# Altium schematic sheet Power Supply.SchDoc: Power Supply
size 431 x 279 mm; DocumentNumber: BMC-125-5321; Revision: A; SheetNumber: 4; SheetTotal: 6
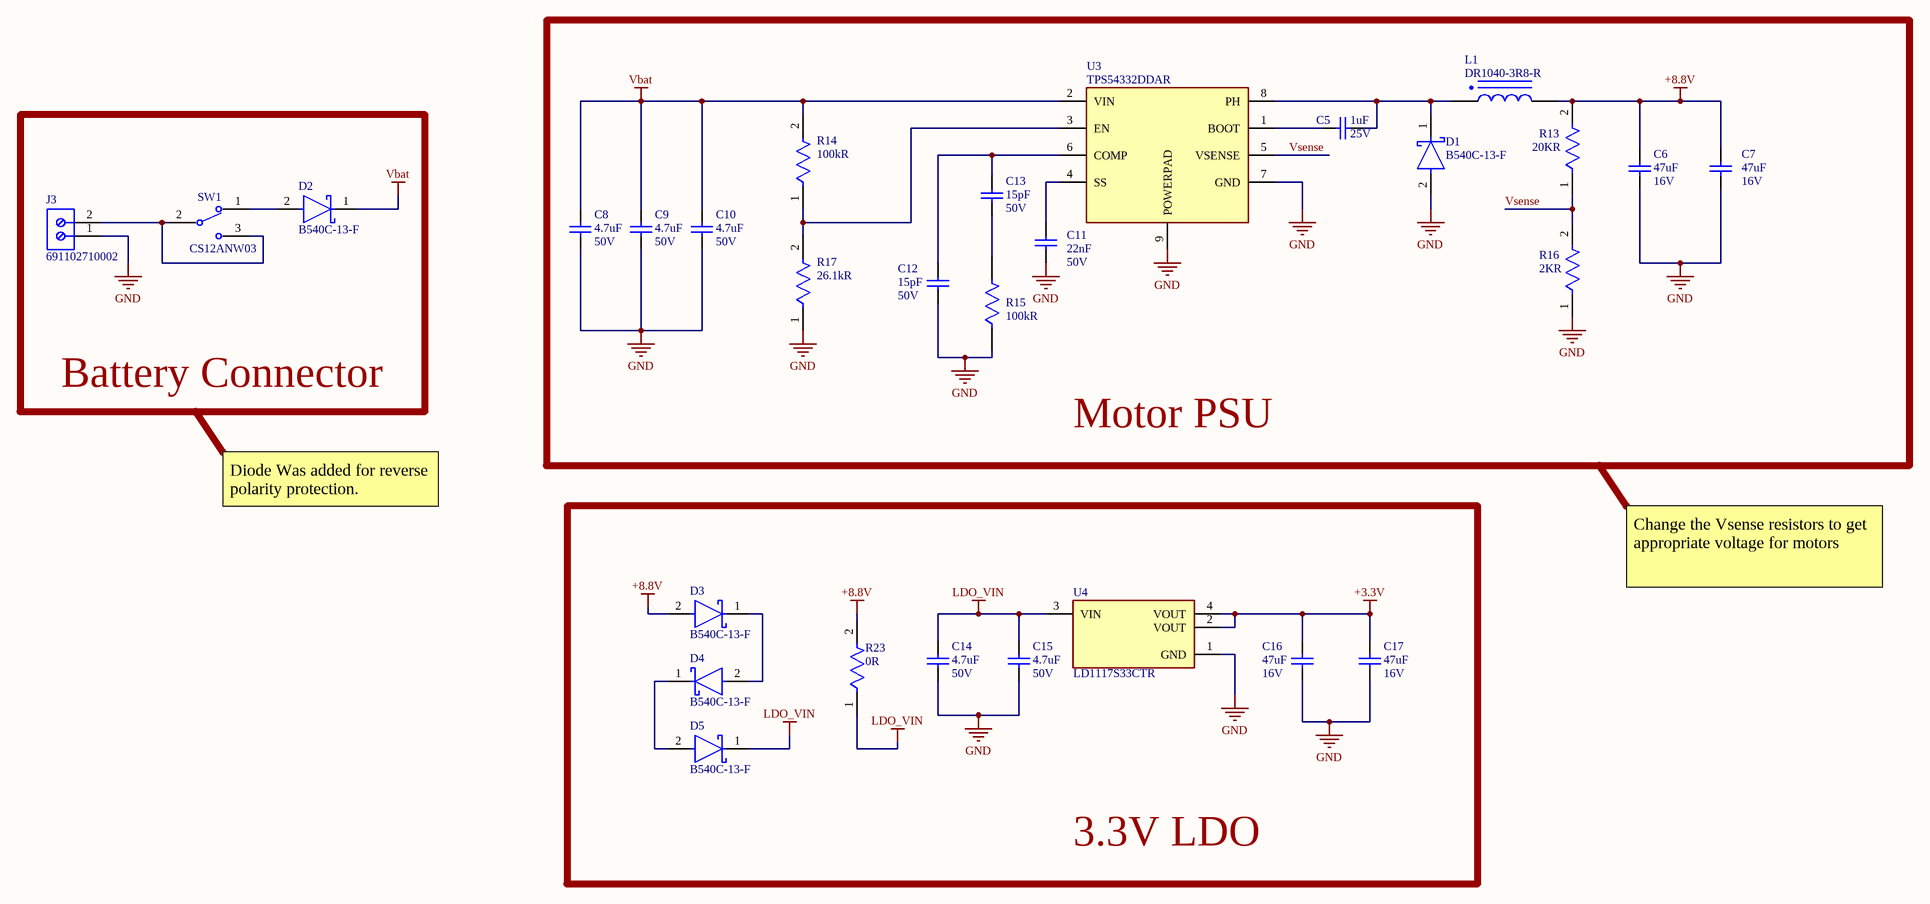
[diagram p0: Power Supply.SchDoc]

## Parts
C5  value 1uF  Voltage Rating: 25V  [FP-CC0603-DA-IPC_B]  (hidden comment: 1uF 25V 0603)
C6  value 47uF  Voltage Rating: 16V  [FP-1210-L_3_2_0_3-W_2_5_0-MFG]  (hidden comment: 47uF 16V 1210)
C7  value 47uF  Voltage Rating: 16V  [FP-1210-L_3_2_0_3-W_2_5_0-MFG]  (hidden comment: 47uF 16V 1210)
C8  value 4.7uF  Voltage Rating: 50V  [FP-GRM21B-0_15-IPC_A]  (hidden comment: 4.7uF 50V 0805)
C9  value 4.7uF  Voltage Rating: 50V  [FP-GRM21B-0_15-IPC_A]  (hidden comment: 4.7uF 50V 0805)
C10  value 4.7uF  Voltage Rating: 50V  [FP-GRM21B-0_15-IPC_A]  (hidden comment: 4.7uF 50V 0805)
C11  value 22nF  Voltage Rating: 50V  [FP-C2012-125-0_2-IPC_A]  (hidden comment: .022uF 50V 0805)
C12  value 15pF  Voltage Rating: 50V  [FP-CC0603-0_9-IPC_A]  (hidden comment: 15pF 50V 0603)
C13  value 15pF  Voltage Rating: 50V  [FP-CC0603-0_9-IPC_A]  (hidden comment: 15pF 50V 0603)
C14  value 4.7uF  Rated DC Voltage (URdc): 50V  [FP-GRM21B-0_15-IPC_A]  (hidden comment: 4.7uF 50V 0805)
C15  value 4.7uF  Rated DC Voltage (URdc): 50V  [FP-GRM21B-0_15-IPC_A]  (hidden comment: 4.7uF 50V 0805)
C16  value 47uF  Rated DC Voltage (URdc): 16V  [FP-1210-L_3_2_0_3-W_2_5_0-MFG]  (hidden comment: CAP)
C17  value 47uF  Rated DC Voltage (URdc): 16V  [FP-1210-L_3_2_0_3-W_2_5_0-MFG]  (hidden comment: CAP)
D1  B540C-13-F  [FP-SMC-MFG]
D2  B540C-13-F  [FP-SMC-MFG]
D3  B540C-13-F  [FP-SMC-MFG]
D4  B540C-13-F  [FP-SMC-MFG]
D5  B540C-13-F  [FP-SMC-MFG]
J3  691102710002  [691102710002]
L1  DR1040-3R8-R  [DR1040-3R8-R-Footprint-1]
R13  20KR  [FP-RC0603-0_55-IPC_C]
R14  value 100kR  [FP-RC0603-0_55-IPC_C]  (hidden comment: 100Kohm 0603)
R15  value 100kR  [FP-RC0603-0_55-IPC_C]  (hidden comment: 100Kohm 0603)
R16  2KR  [FP-AC0603-IPC_B]
R17  value 26.1kR  [FP-RT0603-IPC_C]  (hidden comment: 26.1K Ohm 0603)
R23  0R  [FP-RC0603-MFG]
SW1  CS12ANW03  [FP-CS12ANW03-MFG]
U3  TPS54332DDAR  [SOIC127P600X170-9N]
U4  LD1117S33CTR  [FP-SOT-223-0046067_14-MFG]

## Blocks framed on the sheet
Motor PSU: C5-C13 D1 L1 R13-R17 U3
Battery Connector: D2 J3 SW1
3.3V LDO: C14-C17 D3-D5 R23 U4

## Nets
+3.3V: C16.2 C17.2 U4.2(VOUT) U4.4(VOUT)
+8.8V: C6.2 C7.2 D3.2(A) L1.2 R13.2 R23.2
GND: C6.1 C7.1 C8.1 C9.1 C10.1 C11.1 C12.1 C14.1 C15.1 C16.1 C17.1 D1.2(A) J3.1 R15.1 R16.1 R17.1 U3.7(GND) U3.9(POWERPAD) U4.1(GND)
LDO_VIN: C14.2 C15.2 D5.1(C) R23.1 U4.3(VIN)
Vbat: C8.2 C9.2 C10.2 D2.1(C) R14.2 U3.2(VIN)
Vsense: R13.1 R16.2 U3.5(VSENSE)
NetC5_1: C5.1 D1.1(C) L1.1 U3.8(PH)
NetC5_2: C5.2 U3.1(BOOT)
NetC11_2: C11.2 U3.4(SS)
NetC12_2: C12.2 C13.2 U3.6(COMP)
NetC13_1: C13.1 R15.2
NetD2_2: D2.2(A) SW1.1
NetD3_1: D3.1(C) D4.2(A)
NetD4_1: D4.1(C) D5.2(A)
NetJ3_2: J3.2 SW1.2(2(COM)) SW1.3
NetR14_1: R14.1 R17.2 U3.3(EN)

## Notes on the sheet
- Diode Was added for reverse  polarity protection.
- Change the Vsense resistors to get appropriate voltage for motors
- 4
- 3
- DWG NO.
- REV
- 2
- 1
- ALL INFORMATION IN THIS DRAWING IS THE PROPERTY OF EMAC, AND CANNOT BE COPIED OR USED WITHOUT THE WRITTEN APPROVAL OF EMAC.
- D
- C
- B
- 2025 Bright Manufacturing Challenge
- SCHEMATIC
- A
- SIZE
- CODE IDENT
- 0BJZ8
- NONE
- SCALE
- WEIGHT
- NA
- SHEET
- OF
- REV. A, 06/21/2025
- FORM #PDE-0001-0001

## Library data of the parts
C5 = CMP-00002-5: Ceramic Capacitor, Multilayer, Ceramic, 25V, 10% +Tol, 10% -Tol, X5R, 15% TC, 1uF, Surface Mount, 0603; Multilayer: Yes; Height: 0.8mm; Capacitor Type: Ceramic; Case/Package: 0603; Dielectric Material: Ceramic; JESD-609 Code: e3; Length: 1.6mm; Max Operating Temperature: 85°C; Min Operating Temperature: -55°C; Mounting Technology: Surface Mount; Package Shape: Rectangular; Package Style: SMTMeter; Packaging: Tape and Reel; Pins: 2; Rated DC Voltage (URdc): 25V; Reach SVHC Compliant: Yes; RoHS Compliant: Yes; Temperature Characteristics Code: X5R; Terminal Finish: Nickel; Termination: Wraparound; Tolerance  (fill in as +-): 10%; Tolerance (fill in as +-): 10%; Width: 0.8mm
C6 C7 C16 C17 = CMP-00003-4: Ceramic Capacitor, Multilayer, Ceramic, 16V, 20% +Tol, 20% -Tol, X5R, 15% TC, 47uF, Surface Mount, 1210; Multilayer: Yes; Length: 3.2mm; RoHS Compliant: Yes; Case/Package: 1210; JESD-609 Code: e3; Max Operating Temperature: 85°C; Pins: 2; Packaging: Tape and Reel; Package Style: SMTMeter; Mounting Technology: Surface Mount; Dielectric Material: Ceramic; Reach SVHC Compliant: Yes; Terminal Finish: Nickel; Package Shape: Rectangular; Temperature Characteristics Code: X5R; Height: 2.5mm; Termination: Wraparound; Min Operating Temperature: -55°C; Capacitor Type: Ceramic; Width: 2.5mm; Tolerance (fill in as +-): 20%; Tolerance  (fill in as +-): 20%
  C6 C7: Rated DC Voltage (URdc): 16V
  C16 C17: Voltage Rating: 16V
C8-C10 C14 C15 = CMP-00005-2: Ceramic Capacitor, Multilayer, Ceramic, 50V, 10% +Tol, 10% -Tol, X5R, 15% TC, 4.7uF, Surface Mount, 0805; Multilayer: Yes; Height: 1.25mm; Width: 1.25mm; Packaging: Tape and Reel; Case/Package: 0805; Min Operating Temperature: -55°C; Max Operating Temperature: 85°C; Length: 2mm; Capacitor Type: Ceramic; Dielectric Material: Ceramic; JESD-609 Code: e3; Mounting Technology: Surface Mount; Package Shape: Rectangular; Package Style: SMTMeter; Pins: 2; Reach SVHC Compliant: Yes; RoHS Compliant: Yes; Temperature Characteristics Code: X5R; Terminal Finish: Nickel; Termination: Wraparound; Tolerance  (fill in as +-): 10%; Tolerance (fill in as +-): 10%
  C8-C10: Rated DC Voltage (URdc): 50V
  C14 C15: Voltage Rating: 50V
C11 = CMP-00006-3: Ceramic Capacitor, Multilayer, Ceramic, 50V, 5% +Tol, 5% -Tol, C0G, 30ppm/Cel TC, 0.022uF, Surface Mount, 0805; Multilayer: Yes; Max Operating Temperature: 125°C; Packaging: Tape and Reel; Case/Package: 0805; Length: 2mm; Height: 1.25mm; Termination: Wraparound; Width: 1.25mm; Min Operating Temperature: -55°C; Dielectric Material: Ceramic; RoHS Compliant: Yes; Capacitor Type: Ceramic; JESD-609 Code: e3; Mounting Technology: Surface Mount; Package Shape: Rectangular; Package Style: SMTMeter; Pins: 2; Rated DC Voltage (URdc): 50V; Reach SVHC Compliant: Yes; Temperature Characteristics Code: C0G; Terminal Finish: Nickel; Tolerance  (fill in as +-): 5%; Tolerance (fill in as +-): 5%
C12 C13 = CMP-00007-2: Ceramic Capacitor, Multilayer, Ceramic, 50V, 5% +Tol, 5% -Tol, C0G, 30ppm/Cel TC, 0.000015uF, Surface Mount, 0603; Multilayer: Yes; Height: 0.8mm; Max Operating Temperature: 125°C; Width: 0.8mm; Length: 1.6mm; Packaging: Tape and Reel; RoHS Compliant: Yes; Min Operating Temperature: -55°C; Termination: Wraparound; Dielectric Material: Ceramic; Case/Package: 0603; Capacitor Type: Ceramic; JESD-609 Code: e3; Mounting Technology: Surface Mount; Package Shape: Rectangular; Package Style: SMTMeter; Pins: 2; Rated DC Voltage (URdc): 50V; Reach SVHC Compliant: Yes; Temperature Characteristics Code: C0G; Terminal Finish: Nickel; Tolerance  (fill in as +-): 5%; Tolerance (fill in as +-): 5%
D1-D5 = CMP-00010-1: Rectifier Diode, Schottky, 1 Phase, 1 Element, 5A, 40V V(RRM), Silicon; Application(s): EFFICIENCY; Forward Voltage: 550mV; Non-rep Pk Forward Current-Max: 100A; Number of Elements: 1; Package Body Material: Plastic; Qualification Status: Not Qualified; Time @ Peak Reflow Temperature-Max (s): 40s; Diode Element Material: SILICON; Diode Type: RECTIFIER; JESD-30 Code: R-PDSO-C2; JESD-609 Code: e3; Max Operating Temperature: 125°C; Max Output current: 5A; Min Operating Temperature: -55°C; Moisture Sensitivity Level: 1; Number of Phases: 1; Package Shape: Rectangular; Package Style: SMALL OUTLINEMeter; Peak Reflow Temperature (Cel): 260°C; Pins: 2; Reach SVHC Compliant: No; Rep Pk Reverse Voltage-Max: 40V; RoHS Compliant: Yes; Surface Mount: Yes; Technology: SCHOTTKY; Terminal Finish: Tin; Terminal Form: C BEND; Terminal Position: DUAL
J3 = CMP-00012-1: Barrier Strip Terminal Block; Reach SVHC Compliant: No; RoHS Compliant: Yes; Terminal and Terminal Block Type: BARRIER STRIP TERMINAL BLOCK
L1 = CMP-00026-1: General Purpose Inductor, 3.8uH, 30%, 1 Element, Ferrite-Core, SMD, 4141; Case/Size Code: 4141; Channels: 1; DC Resistance (DCR): 13mR; Inductor Application: POWER INDUCTOR; Max Current Rating: 6.4A; Package Height: 4mm; Package Length: 10.5mm; Package Width: 10.3mm; Shape/Size Description: RECTANGULAR PACKAGE; Shielding: Shielded; Test Frequency: 100kHz; Construction: Shielded; Core Material: Ferrite; Inductance-Nom (L): 3.8uH; Inductor Type: GENERAL PURPOSE INDUCTOR; Max Operating Temperature: 125°C; Min Operating Temperature: -40°C; Package Style: SMTMeter; Packaging: Tape and Reel; Pins: 2; Reach SVHC Compliant: Yes; RoHS Compliant: Yes; Surface Mount: Yes; Terminal Placement: Dual Ended; Termination: Wraparound; Tolerance: 30%
R13 = CMP-2000-06932-2: RES 20K OHM 1% 1/10W 0603; Voltage Rating: 50V; Temperature Coefficient: 100ppm/°C; Power Rating: 100mW; Height: 0.022inch; REACH SVHC: No SVHC; Case Code (Metric): 1608; Depth: 0.8mm; Tolerance: 1%; Min Operating Temperature: -55°C; Series: RC; RoHS Compliant: Yes; Resistor Type: Thick Film; Max Power Dissipation: 100mW; Features: Moisture Resistant; Max Operating Temperature: 155°C; Package Quantity: 1; Size Code: 0603; Packaging: Tape and Reel; Width: 0.031inch; Length: 0.063inch; Military Standard: Not; Technology: THICK FILM; Number of Terminations: 2; Termination: SMD/SMT; Resistance: 20kR; Construction: Rectangular; Case/Package: 0603; Number of Pins: 2; Lead Free: Lead Free; Voltage Rating (DC): 50V; Resistance Tolerance: 1%; Case Code (Imperial): 0603
R14 R15 = CMP-00015-1: Fixed Resistor, Metal Glaze/thick Film, 0.1W, 100000ohm, 75V, 1% +/-Tol, 100ppm/Cel, Surface Mount, 0603; Additional Feature: LASER TRIMMABLE; Package Height: 0.45mm; Package Length: 1.6mm; Package Width: 0.8mm; Power: 100mW; Rated Temperature: 70°C; Temperature Coefficient (ppm/Cel): 100; Packaging: Tape and Reel; Termination: Wraparound; Resistor Type: FIXED RESISTOR; Construction: Chip; Case/Package: 0603; Technology: METAL GLAZE/THICK FILM; RoHS Compliant: Yes; Working Voltage: 75V; Min Operating Temperature: -55°C; Max Operating Temperature: 155°C; Tolerance: 1%; JESD-609 Code: e3; Mounting Technology: Surface Mount; Package Shape: Rectangular; Pins: 2; Reach SVHC Compliant: Yes; Terminal Finish: Nickel
R16 = CMP-03412-037842-1: RES 2kΩ 1.00% 0.1W 0603; Tolerance: 1%; Resistance: 2kR; RoHS Compliant: Yes; Case/Package: 0603
R17 = CMP-00017-1: Fixed Resistor, Thin Film, 0.1W, 26100ohm, 75V, 0.1% +/-Tol, 25ppm/Cel, Surface Mount, 0603; Package Height: 0.45mm; Package Length: 1.6mm; Package Width: 0.8mm; Power: 100mW; Rated Temperature: 70°C; Temperature Coefficient (ppm/Cel): 25; Tolerance: 0.1%; Case/Package: 0603; Construction: Chip; Max Operating Temperature: 155°C; Min Operating Temperature: -55°C; Mounting Technology: Surface Mount; Packaging: Tape and Reel; Pins: 2; Reach SVHC Compliant: Yes; Resistor Type: FIXED RESISTOR; RoHS Compliant: Yes; Technology: THIN FILM; Termination: Wraparound; Working Voltage: 75V
R23 = CMP-2000-06925-2: RES SMD 0 OHM JUMPER 1/10W 0603; Manufacturer: Yageo; Manufacturer Part Number: RC0603FR-070RL; Tolerance: 1%; Value: 0Ω; Power Rating: 0.1W; Voltage Rating: 75V; Composition: Thick Film; Temperature Range Low: -55°C; Ipc Land Pattern Name: RESC16080X45; Lead Free: Yes; Digikey Description: RES SMD 0 OHM JUMPER 1/10W 0603; Height: 0.55mm; Automotive: No; Device Class L3: Chip SMD Resistors; Device Class L1: Passive Components; Device Class L2: Resistors; Footprint Url: http://www.yageo.com/exep/pages/download/literatures/PYu-R_Mount_10.pdf; Category: Res; Mouser Description: RC Series 0603 0.1 W 0 O Jumper Surface Mount Thick Film Chip Resistor; Resistance: 0Ω; ComponentLink2URL: http://www.yageo.com/documents/recent/PYu-RC_Group_51_RoHS_L_10.pdf; Series: RC_L; ComponentLink2Description: Datasheet; RoHS: TRUE; Temperature: -55°C to +155°C; Temperature Range High: +155°C; Package: RC0603; Octopart: https://octopart.com/rc0603fr-070rl-yageo-1180803
SW1 = CMP-00019-1: Slide Switch; RoHS Compliant: Yes; Reach SVHC Compliant: Yes; Switch Type: Slide Switch
U3 = CMP-00028-1: Switching Regulator, Current-mode, 3.5A, 1000kHz Switching Freq-Max, PDSO8; Channels: 1; Control Technique: PULSE WIDTH MODULATION; Frequency: 1.2MHz; Max Supply Voltage: 28V; Min Input Voltage: 3.5V; Nominal Supply Voltage: 12V; Package Body Material: Plastic; Package Equivalence Code: SOP8,.25; Qualification Status: Not Qualified; Switcher Configuration: BUCK; Case/Package: HLSOP; Control Mode: CURRENT-MODE; Height - Seated (Max): 1.68mm; JESD-30 Code: R-PDSO-G8; JESD-609 Code: e4; Length: 4.89mm; Max Operating Temperature: 150°C; Min Operating Temperature: -40°C; Moisture Sensitivity Level: 2; Package Shape: Rectangular; Package Style: SMALL OUTLINE, HEAT SINK/SLUG, LOW PROFILEMeter; Peak Reflow Temperature (Cel): 260°C; Pins: 8; Reach SVHC Compliant: Yes; RoHS Compliant: Yes; Surface Mount: Yes; Temperature Grade: AUTOMOTIVE; Terminal Finish: Nickel; Terminal Form: Gull Wing; Terminal Pitch: 1.27mm; Terminal Position: DUAL; Throw Configuration: SWITCHING REGULATOR; Width: 3.9mm
U4 = CMP-00022-1: Fixed Positive LDO Regulator, 3.3V, 1.3V Dropout, BIPolar, PDSO4; Min Input Voltage: 4.75V; Max Supply Voltage: 15V; Number of Outputs: 1; Dropout Voltage1-Nom: 1.1V; Output Current1-Max: 1.3A; Output Voltage1-Max: 3.44V; Output Voltage1-Min: 3.16V; Package Body Material: Plastic; Qualification Status: Not Qualified; Regulator Type: FIXED POSITIVE SINGLE OUTPUT LDO REGULATOR; Voltage Tolerance-Max: 4.2%; Case/Package: SOP; Width: 3.5mm; Length: 6.5mm; Packaging: Tape and Reel; Adjustability: FIXED; Channels: 1; Dropout Voltage1-Max: 1.3V; Height - Seated (Max): 1.9mm; Input Voltage Absolute-Max: 15V; JESD-30 Code: R-PDSO-G3; JESD-609 Code: e3; Moisture Sensitivity Level: 1; Operating Temperature, TJ-Max: 125°C; Operating Temperature, TJ-Min: -40°C; Output Voltage1-Nom: 3.3V; Package Shape: Rectangular; Pins: 3; Reach SVHC Compliant: No; RoHS Compliant: Yes; Surface Mount: Yes; Technology: BIPOLAR; Terminal Finish: Tin; Terminal Form: Gull Wing; Terminal Pitch: 2.3mm; Terminal Position: DUAL